# EAGLE design circuit5 (EAGLE 7.1.0)
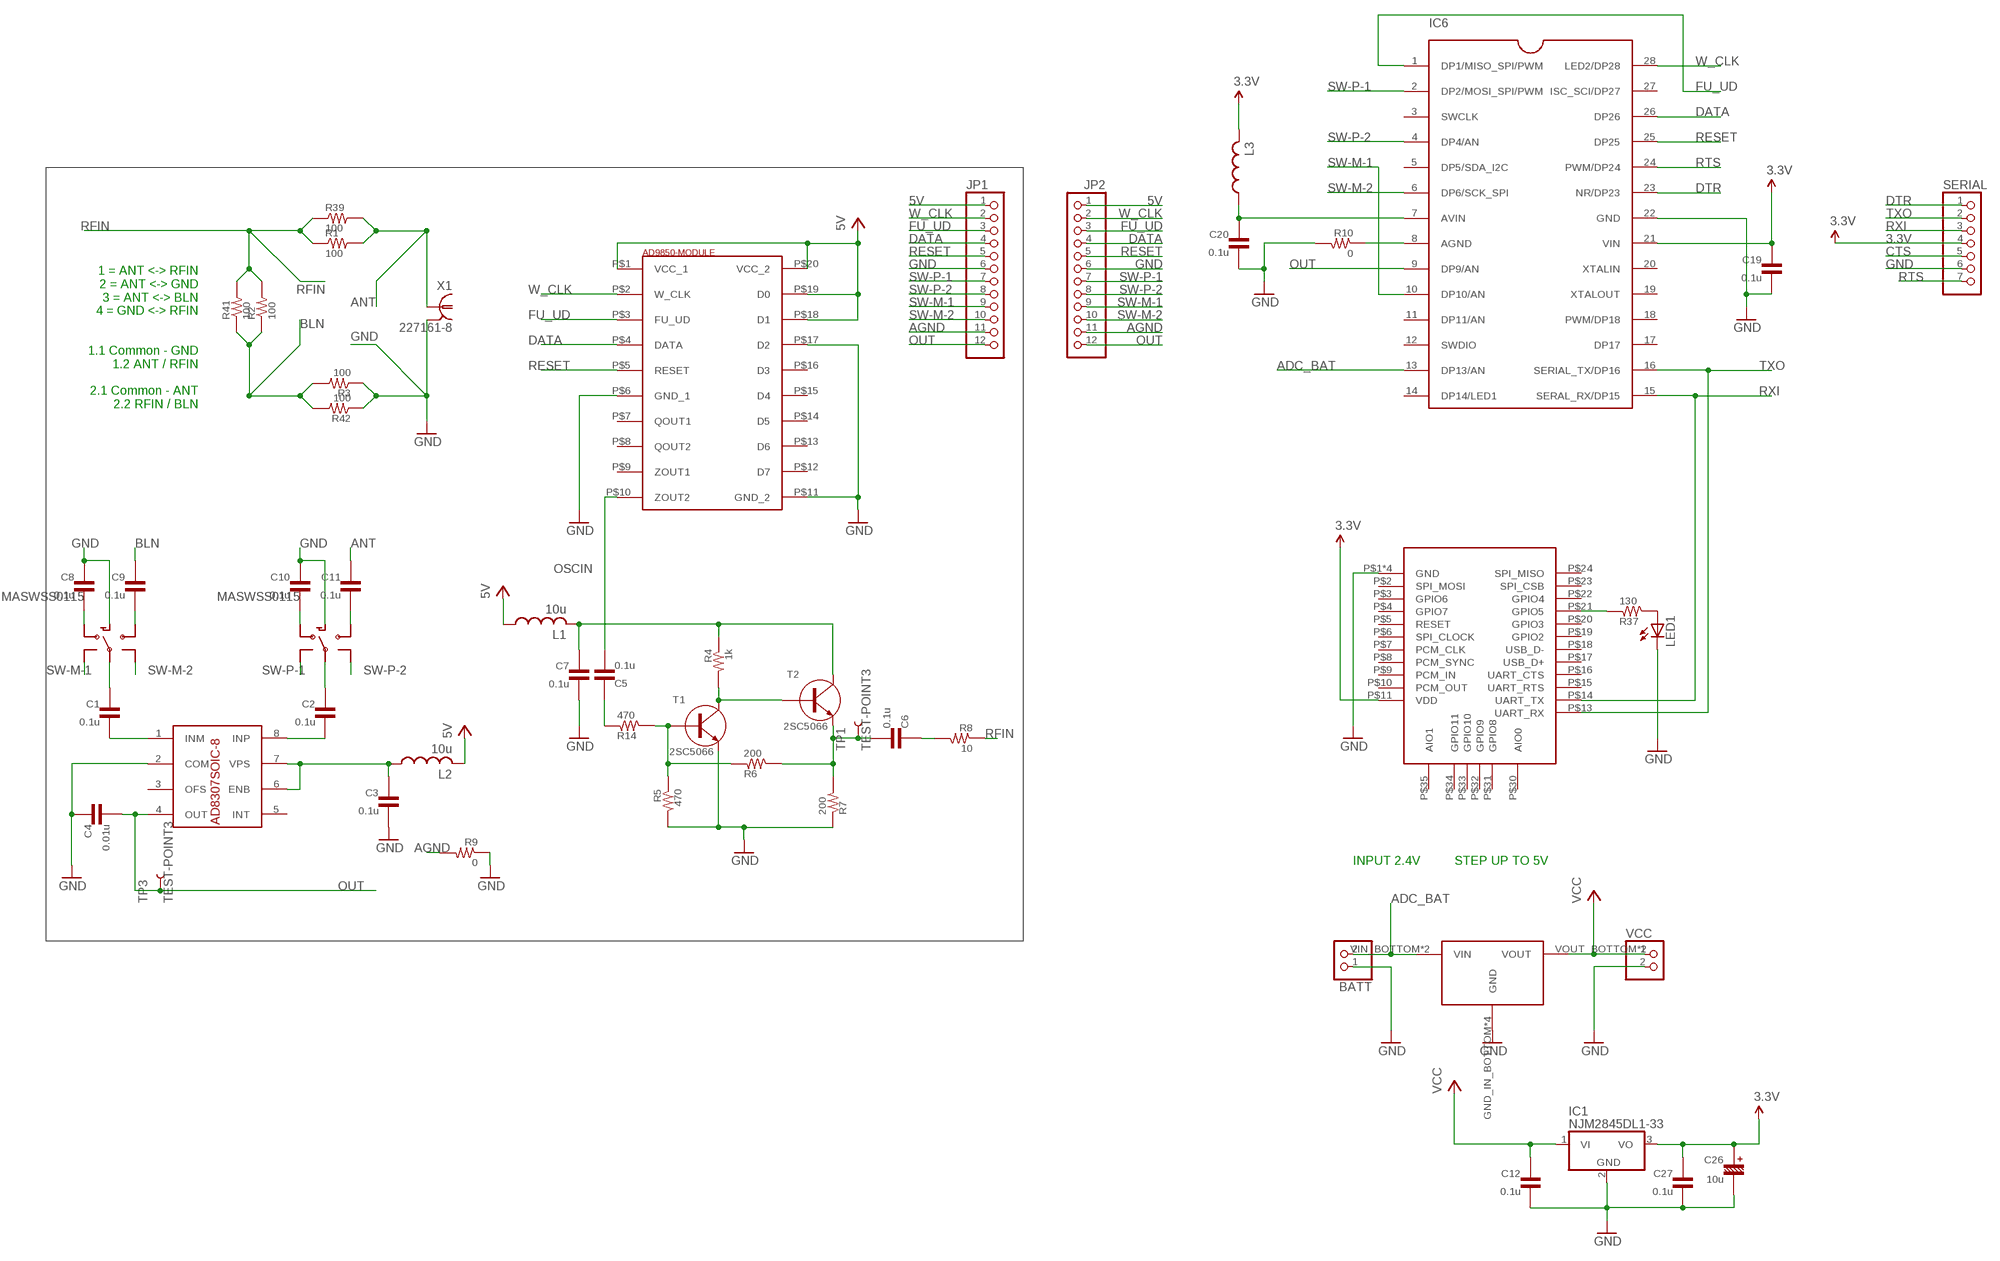
[diagram p0: schematic, sheet 1]

## Parts
BATT  PINHD-1X2  [1X02]
C1  0.1u  C-CP-1608  [CP1608]
C2  0.1u  C-CP-1608  [CP1608]
C3  0.1u  C-CP-1608  [CP1608]
C4  0.01u  C-CP-1608  [CP1608]
C5  0.1u  C-CP-1608  [CP1608]
C6  0.1u  C-CP-1608  [CP1608]
C7  0.1u  C-CP-1608  [CP1608]
C8  0.1u  C-CP-1608  [CP1608]
C9  0.1u  C-CP-1608  [CP1608]
C10  0.1u  C-CP-1608  [CP1608]
C11  0.1u  C-CP-1608  [CP1608]
C12  0.1u  C-CP-1608  [CP1608]
C19  0.1u  C-CP-1608  [CP1608]
C20  0.1u  C-CP-1608  [CP1608]
C26  10u  CE-16V-04-2.54  [16V-4-2.54]
C27  0.1u  C-CP-1608  [CP1608]
IC1  NJM2845DL1-33  7805DT  [TO252]
IC6  LPC1114FN28  [DIP28]
JP1  PINHD-1X12  [1X12]
JP2  PINHD-1X12  [1X12]
L1  10u  L-  [CP1608]
L2  10u  L-  [CP1608]
L3  L-  [CP1608]
LED1  LED3MM  [LED3MM]
R1  100  R-CP-1608  [CP1608]
R2  100  R-CP-1608  [CP1608]
R3  100  R-CP-1608  [CP1608]
R4  1k  R-CP-1608  [CP1608]
R5  470  R-CP-1608  [CP1608]
R6  200  R-CP-1608  [CP1608]
R7  200  R-CP-1608  [CP1608]
R8  10  R-CP-1608  [CP1608]
R9  0  R-CP-1608  [CP1608]
R10  0  R-CP-1608  [CP1608]
R14  470  R-CP-1608  [CP1608]
R37  130  R-CP-1608  [CP1608]
R39  100  R-CP-1608  [CP1608]
R41  100  R-CP-1608  [CP1608]
R42  100  R-CP-1608  [CP1608]
SERIAL  PINHD-1X7  [1X07]
T1  2SC5066  TR-NPN-SSM  [SSM]
T2  2SC5066  TR-NPN-SSM  [SSM]
TP1  TEST-POINT3  [PAD.03X.03]
TP3  TEST-POINT3  [PAD.03X.03]
U$1  AD9850-MODULE  [AD9850-MODULE]
U$2  RN-42  [RN-42]
U$3  AD8307SOIC-8  [SO08]
U$4  DC-DCSX1308  [DC-DC-SX1308]
U$5  MASWSS0115  [SOT363]
U$6  MASWSS0115  [SOT363]
VCC  PINHD-1X2  [1X02]
X1  227161-8  [AMP_227161]

## Nets
3.3V: C19.SMD1 C26.+ C27.SMD1 IC1.3(VO) IC6.21(VIN) L3.SMD2 SERIAL.4 U$2.P$11(VDD)
5V: C12.SMD1 IC1.1(VI) JP1.1 JP2.1 L1.SMD1 L2.SMD2 U$1.P$1(VCC_1) U$1.P$18(D1) U$1.P$19(D0) U$1.P$20(VCC_2) U$4.VOUT_BOTTOM(VOUT) U$4.VOUT_TOP(VOUT) VCC.1 ; supply symbol labelled VCC
+12V-ANALOG: C7.SMD1 L1.SMD2 R4.SMD1 T2.P$3(C)
ADC_BAT: BATT.2 IC6.13(DP13/AN) U$4.VIN_BOTTOM(VIN) U$4.VIN_TOP(VIN)
AGND: IC6.8(AGND) JP1.11 JP2.11 R9.SMD2 R10.SMD1
ANT: C11.SMD1 R1.SMD2 R39.SMD2 X1.1
BLN: C9.SMD1 R2.SMD1 R3.SMD2 R41.SMD1 R42.SMD2
CTS: SERIAL.5
DATA: IC6.26(DP26) JP1.4 JP2.4 U$1.P$4(DATA)
DTR: IC6.23(NR/DP23) SERIAL.1
FU_UD: IC6.1(DP1/MISO_SPI/PWM) JP1.3 JP2.3 U$1.P$3(FU_UD)
GND: BATT.1 C3.SMD2 C4.SMD1 C7.SMD2 C8.SMD1 C10.SMD1 C12.SMD2 C19.SMD2 C20.SMD2 C26.- C27.SMD2 IC1.2(GND) IC6.22(GND) JP1.6 JP2.6 LED1.K(C) R3.SMD1 R5.SMD2 R7.SMD1 R9.SMD1 R10.SMD2 R42.SMD1 SERIAL.6 T1.P$2(E) U$1.P$6(GND_1) U$1.P$11(GND_2) U$1.P$17(D2) U$2.P$1(GND) U$2.P$12(GND) U$2.P$28(GND) U$2.P$29(GND) U$3.2(COM) U$4.GND_IN_BOTTOM(GND) U$4.GND_IN_TOP(GND) U$4.GND_OUT_BOTTOM(GND) U$4.GND_OUT_TOP(GND) U$5.2(GND) U$6.2(GND) VCC.2 X1.2
N$1: C2.SMD1 U$6.5(COMMON)
N$2: C1.SMD1 U$5.5(COMMON)
N$4: R4.SMD2 T1.P$3(C) T2.P$1(B)
N$5: R5.SMD1 R6.SMD1 R14.SMD2 T1.P$1(B)
N$6: C8.SMD2 U$5.3(RF2)
N$7: C6.SMD2 R6.SMD2 R7.SMD2 T2.P$2(E) TP1.P$1
N$8: C1.SMD2 U$3.1(INM)
N$9: C2.SMD2 U$3.8(INP)
N$10: C3.SMD1 L2.SMD1 U$3.6(ENB) U$3.7(VPS)
N$11: C9.SMD2 U$5.1(RF1)
N$12: C10.SMD2 U$6.3(RF2)
N$13: C5.SMD1 R14.SMD1
N$14: C11.SMD2 U$6.1(RF1)
N$23: C6.SMD1 R8.SMD2
N$31: C20.SMD1 IC6.7(AVIN) L3.SMD1
N$32: LED1.A R37.SMD2
N$33: R37.SMD1 U$2.P$21(GPIO5)
OSCIN: C5.SMD2 U$1.P$10(ZOUT2)
OUT: C4.SMD2 IC6.9(DP9/AN) JP1.12 JP2.12 TP3.P$1 U$3.4(OUT)
RESET: IC6.25(DP25) JP1.5 JP2.5 U$1.P$5(RESET)
RFIN: R1.SMD1 R2.SMD2 R8.SMD1 R39.SMD1 R41.SMD2
RTS: IC6.24(PWM/DP24) SERIAL.7
RXI: IC6.15(SERAL_RX/DP15) SERIAL.3 U$2.P$14(UART_TX)
SW-M-1: IC6.10(DP10/AN) JP1.9 JP2.9 U$5.4(V2)
SW-M-2: IC6.6(DP6/SCK_SPI) JP1.10 JP2.10 U$5.6(V1)
SW-P-1: IC6.2(DP2/MOSI_SPI/PWM) JP1.7 JP2.7 U$6.4(V2)
SW-P-2: IC6.4(DP4/AN) JP1.8 JP2.8 U$6.6(V1)
TXO: IC6.16(SERIAL_TX/DP16) SERIAL.2 U$2.P$13(UART_RX)
W_CLK: IC6.28(LED2/DP28) JP1.2 JP2.2 U$1.P$2(W_CLK)
Unconnected: IC6.3(SWCLK) IC6.5(DP5/SDA_I2C) IC6.11(DP11/AN) IC6.12(SWDIO) IC6.14(DP14/LED1) IC6.17(DP17) IC6.18(PWM/DP18) IC6.19(XTALOUT) IC6.20(XTALIN) IC6.27(ISC_SCI/DP27) U$1.P$7(QOUT1) U$1.P$8(QOUT2) U$1.P$9(ZOUT1) U$1.P$12(D7) U$1.P$13(D6) U$1.P$14(D5) U$1.P$15(D4) U$1.P$16(D3) U$2.P$2(SPI_MOSI) U$2.P$3(GPIO6) U$2.P$4(GPIO7) U$2.P$5(RESET) U$2.P$6(SPI_CLOCK) U$2.P$7(PCM_CLK) U$2.P$8(PCM_SYNC) U$2.P$9(PCM_IN) U$2.P$10(PCM_OUT) U$2.P$15(UART_RTS) U$2.P$16(UART_CTS) U$2.P$17(USB_D+) U$2.P$18(USB_D-) U$2.P$19(GPIO2) U$2.P$20(GPIO3) U$2.P$22(GPIO4) U$2.P$23(SPI_CSB) U$2.P$24(SPI_MISO) U$2.P$30(AIO0) U$2.P$31(GPIO8) U$2.P$32(GPIO9) U$2.P$33(GPIO10) U$2.P$34(GPIO11) U$2.P$35(AIO1) U$3.3(OFS) U$3.5(INT)

## Notes on the sheet
- 1 = ANT <-> RFIN
  2 = ANT <-> GND
  3 = ANT <-> BLN
  4 = GND <-> RFIN
  
  
  1.1 Common - GND
  1.2 ANT / RFIN
  
  2.1 Common - ANT
  2.2 RFIN / BLN
- INPUT 2.4V | STEP UP TO 5V

## Library data of the parts
BATT VCC = pinhead:PINHD-1X2: PIN HEADER
C1-C12 C19 C20 C27 = my:C-: CAPACITOR Japanese symbol
C26 = my:CE-: ELECTROLYTIC CAPACITOR Japanese symbol
IC1 = my:78*: Positive VOLTAGE REGULATOR Source: http://cache.national.com/ds/LM/LM78L05.pdf http://www.fairchildsemi.com/ds/LM/LM7805.pdf
IC6 = lpc1114fn28:LPC1114FN28
JP1 JP2 = pinhead:PINHD-1X12: PIN HEADER
L1-L3 = my:L-: INDUCTOR, American symbol
LED1 = SparkFun-LED:LED: LEDs Standard schematic elements and footprints for 5mm, 3mm, 1206, and 0603 sized LEDs. 5mm - Spark Fun Electronics SKU : COM-00529 (and others)
R1-R10 R14 R37 R39 R41 R42 = my:R-: RESISTOR Japanese symbol
SERIAL = pinhead:PINHD-1X7: PIN HEADER
T1 T2 = my:TR-NPN-: TRANSISTOR (Bipolar transistor) NPN type Japanese symbol
TP1 TP3 = SparkFun-Passives:TEST-POINT: Bare copper test points for troubleshooting or ICT
U$1 = my:AD9850-MODULE
U$2 = my:RN-42
U$3 = my:AD8307
U$4 = my:DC-DC
U$5 U$6 = my:MASWSS0115
X1 = con-coax:?227161*: JACK, RIGHT ANGLE, 50 OHM, PCB, BNC Source: amp_227161.pdf; OC_FARNELL: unknown; OC_NEWARK: unknown

## Board
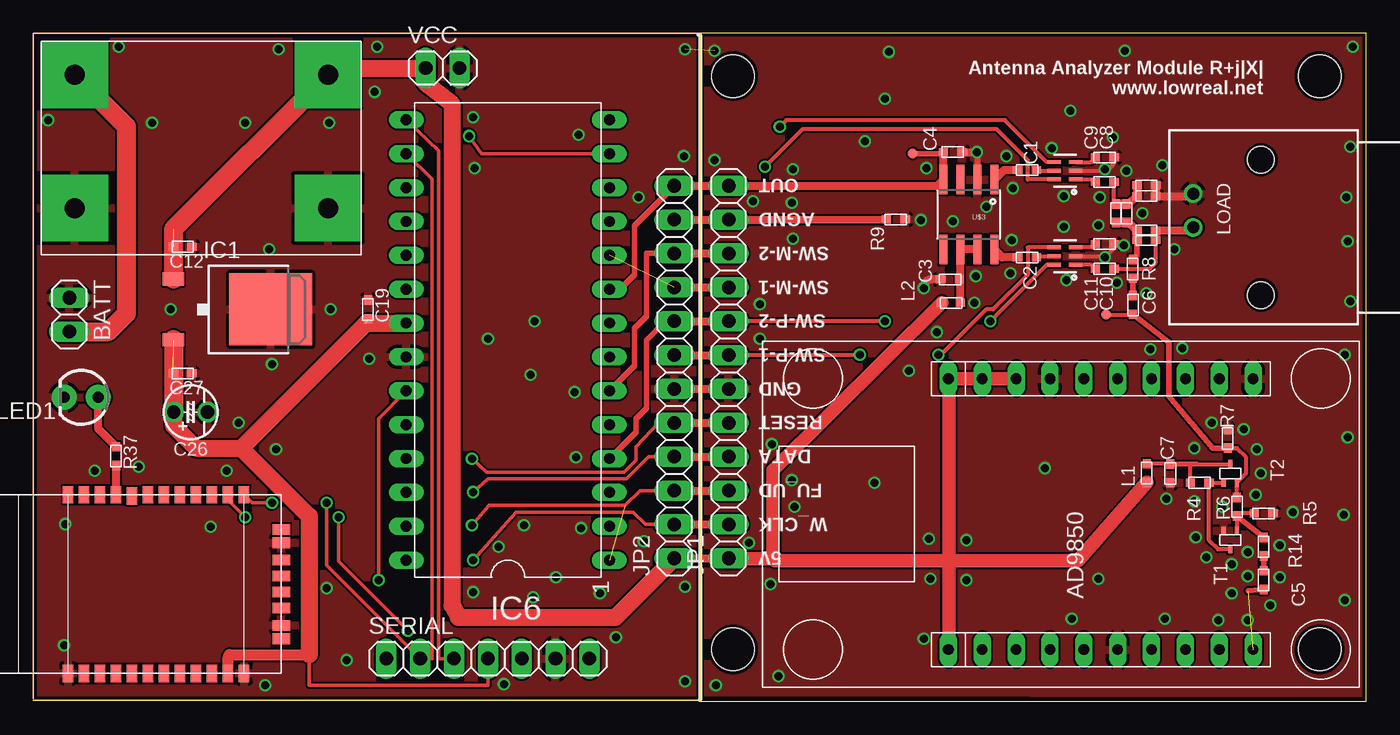
[diagram p1: board, top side]
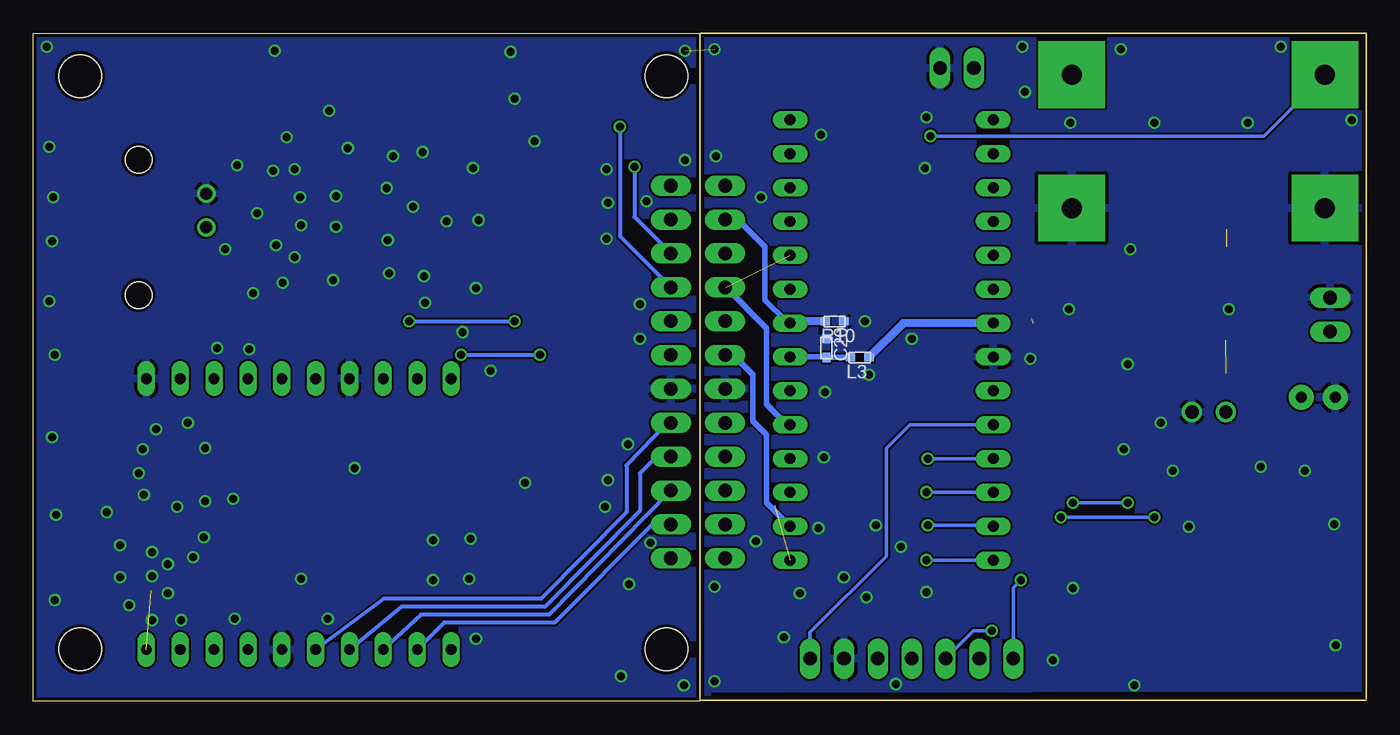
[diagram p2: board, bottom side, seen from below]

Size 100 x 50.1 mm. Coordinates in mm from the lower left corner, seen from the top.
Outline: 50,0.1 50,0 100,0 100,50.1 50,50.1
Outline: 0,0.1 50,0.1
Outline: 0,0.2 0,50.1 50,50.1
Outline: 50,50.1 50,0.1
Copper layers (1*16): Top 0.035mm / dielectric 1.5mm / Bottom 0.035mm
Design rules "Elecrow_2-layer_eagle_rule": minimum track width 6mil, minimum drill 12mil, track to track 6mil, track to pad 6mil, pad to pad 6mil, via to via 6mil, smd to smd 0mil, copper to edge 10mil, drill to drill 10mil, minimum pad ring 10mil, minimum via ring 6mil, stop-mask expansion 2mil, vias tented up to drill 100mil, thermal gap 10mil
Holes 3.2 mm at 96.5,46.9 52.5,46.9 52.5,3.9 96.5,3.9

### Footprints (pad centres in the part's own frame; a part is rotated, then mirrored left to right if it is on the bottom)
1X02 = drill 1.016 long: 1 -1.27,0; 2 1.27,0
CP1608 = smd 0.7 x 0.6: SMD1 -0.7,0; SMD2 0.7,0
16V-4-2.54 = drill 1: + -1.27,0; - 1.27,0
TO252 = smd 1 x 1.6: 1 -2.28,-4.8; 3 2.28,-4.8 | smd 5.4 x 6.2: 2 0,2.5
DIP28 = drill 0.813 long: 1 -16.51,-7.62; 2 -13.97,-7.62; 3 -11.43,-7.62; 4 -8.89,-7.62; 5 -6.35,-7.62; 6 -3.81,-7.62; 7 -1.27,-7.62; 8 1.27,-7.62; 9 3.81,-7.62; 10 6.35,-7.62; 11 8.89,-7.62; 12 11.43,-7.62; 13 13.97,-7.62; 14 16.51,-7.62; 15 16.51,7.62; 16 13.97,7.62; 17 11.43,7.62; 18 8.89,7.62; 19 6.35,7.62; 20 3.81,7.62; 21 1.27,7.62; 22 -1.27,7.62; 23 -3.81,7.62; 24 -6.35,7.62; 25 -8.89,7.62; 26 -11.43,7.62; 27 -13.97,7.62; 28 -16.51,7.62
1X12 = drill 1.016 long: 1 -13.97,0; 2 -11.43,0; 3 -8.89,0; 4 -6.35,0; 5 -3.81,0; 6 -1.27,0; 7 1.27,0; 8 3.81,0; 9 6.35,0; 10 8.89,0; 11 11.43,0; 12 13.97,0
LED3MM = drill 0.813 pad 1.88: A -1.27,0; K 1.27,0
1X07 = drill 1.016 long: 1 -7.62,0; 2 -5.08,0; 3 -2.54,0; 4 0,0; 5 2.54,0; 6 5.08,0; 7 7.62,0
SSM = smd 0.305 x 0.61: P$1 -0.5,-0.7; P$2 0.5,-0.7; P$3 0,0.7
PAD.03X.03 = smd 0.762 x 0.762: P$1 0,0
AD9850-MODULE = drill 0.8 long: P$1 -5.08,2.54; P$2 -5.08,0; P$3 -5.08,-2.54; P$4 -5.08,-5.08; P$5 -5.08,-7.62; P$6 -5.08,-10.16; P$7 -5.08,-12.7; P$8 -5.08,-15.24; P$9 -5.08,-17.78; P$10 -5.08,-20.32; P$11 15.24,-20.32; P$12 15.24,-17.78; P$13 15.24,-15.24; P$14 15.24,-12.7; P$15 15.24,-10.16; P$16 15.24,-7.62; P$17 15.24,-5.08; P$18 15.24,-2.54; P$19 15.24,0; P$20 15.24,2.54
RN-42 = smd 1.3 x 0.8: P$1 0,16; P$2 0,14.8; P$3 0,13.6; P$4 0,12.4; P$5 0,11.2; P$6 0,10; P$7 0,8.8; P$8 0,7.6; P$9 0,6.4; P$10 0,5.2; P$11 0,4; P$12 0,2.8; P$13 13.4,2.8; P$14 13.4,4; P$15 13.4,5.2; P$16 13.4,6.4; P$17 13.4,7.6; P$18 13.4,8.8; P$19 13.4,10; P$20 13.3,11.2; P$21 13.4,12.4; P$22 13.4,13.6; P$23 13.4,14.8; P$24 13.4,16 | smd 0.8 x 1.3: P$28 9.8,0; P$29 3.6,0; P$30 10.8,0; P$31 8.5,0; P$32 7.3,0; P$33 6.1,0; P$34 4.9,0; P$35 2.6,0
SO08 = smd 0.61 x 2.21: 1 -1.905,-2.616; 2 -0.635,-2.616; 3 0.635,-2.616; 4 1.905,-2.616; 5 1.905,2.616; 6 0.635,2.616; 7 -0.635,2.616; 8 -1.905,2.616
DC-DC-SX1308 = drill 1.5 pad 5 square: GND_IN_BOTTOM 0.5,1.5; GND_OUT_BOTTOM 19.5,1.5; VIN_BOTTOM 0.5,11.5; VOUT_BOTTOM 19.5,11.5 | smd 5 x 5: GND_IN_TOP 0.5,1.5; GND_OUT_TOP 19.5,1.5; VIN_TOP 0.5,11.5; VOUT_TOP 19.5,11.5
SOT363 = smd 0.3 x 0.99: 1 -0.65,-0.8; 2 0,-0.8; 3 0.65,-0.8; 4 0.65,0.81; 5 0,0.81; 6 -0.65,0.81
AMP_227161 = drill 0.9 pad 1.27: 1 0,-5.08; 2 -2.54,-5.08 | hole 2: -5.08,0; 5.08,0

### Placement (x,y rotation side)
BATT  2.7,29 270 top
C1  74.56,39.85 180 top
C2  74.56,33.3 180 top
C3  68.78,31.65 180 top
C4  68.98,41.2 180 top
C5  92.3,9.1 270 top
C6  82.5,29.73 270 top
C7  85.3,17.1 270 top
C8  80.38,40.8 180 top
C9  80.38,38.95 180 top
C10  80.38,34.3 180 top
C11  80.38,32.45 180 top
C12  11.2,34.1 0 top
C19  25.1,29.4 90 top
C20  40.5,26.5 90 bottom
C26  11.8,21.7 0 top
C27  11.2,24.6 0 top
IC1  15.3,29.4 270 top
IC6  35.6,27.1 90 top
JP1  52.16,24.7 90 top
JP2  48.1,24.7 90 top
L1  83.53,17.12 90 top
L2  68.86,29.88 180 top
L3  38,25.8 0 bottom
LED1  3.6,22.8 180 top
R1  83.5,35.3 0 top
R2  82,36.61 270 top
R3  83.5,38.7 180 top
R4  87.5,16.4 0 top
R5  92.3,14.1 0 top
R6  90.3,14.6 90 top
R7  89.6,19.7 270 top
R8  82.48,32.43 270 top
R9  64.7,36.14 180 top
R10  39.9,28.5 0 bottom
R14  92.3,11.6 90 top
R37  6.2,18.4 90 top
R39  83.5,34.6 0 top
R41  81.23,36.61 270 top
R42  83.5,37.9 180 top
SERIAL  34.1,3.2 0 top
T1  89.8,12.1 180 top
T2  89.8,17.1 0 top
TP1  80.5,29 270 top
TP3  65.98,41.08 270 top
U$1  71.2,8.96 90 top
U$2  18.6,2.1 90 top
U$3  70.19,36.51 180 top
U$4  2.6,35.5 0 top
U$5  77.4,39.8 90 top
U$6  77.4,33.4 90 top
VCC  30.7,47.5 0 top
X1  92.1,35.54 270 top

### Tracks (layer width: path | path; a pad name or v marks a point on that pad's centre or on a via)
3.3V  (2 unrouted)
  Top 0.254: 20.7,3.5 20.7,1.2 34.1,1.2 SERIAL.4
  Top 0.813: U$2.P$11 14.6,3.2 14.7,3.5 20.7,3.5
  Top 1.27: C26.+ 10.53,20.67 12.2,19 15.6,19 | 15.6,19 20.7,13.9 20.7,3.5 | 15.6,19 24.97,28.37 IC6.21
  Top 1.422: IC1.3 10.53,27.09 C26.+
  Bottom 0.61: IC6.21 34.73,28.37 L3.SMD2
5V  (1 unrouted)
  Top 0.61: JP2.1 JP1.1
  Top 1.016: JP1.1 52.19,10.7 55.5,10.7 | 55.5,10.7 55.5,17.32 L2.SMD2 | 55.5,10.7 55.65,10.55 68.7,10.55 | U$1.P$18 U$1.P$19 U$1.P$20 68.7,24.16 68.7,10.55 | L1.SMD1 78.36,10.55 68.7,10.55 | U$1.P$1 68.7,3.92 68.7,10.55
  Top 1.27: 22.6,47.5 VCC.1 29.43,46.37 31.4,44.8 31.4,7.2 31.9,6.3 43.67,6.3 JP2.1
  Top 1.422: 22.6,47.5 U$4.VOUT_BOTTOM 10.5,35.4 IC1.1
+12V-ANALOG
  Top 0.305: T2.P$3 C7.SMD1 87.28,17.82 86.8,17.82 | 86.8,17.82 L1.SMD2 | R4.SMD1 86.8,17.82
ADC_BAT  (via drill 0.6)
  Top 0.254: IC6.13 33.63,41.07 v32.7,42.4
  Top 1.422: BATT.2 5.63,27.73 7,29.1 7,43.1 U$4.VIN_TOP
  Bottom 0.254: v32.7,42.4 7.7,42.4 U$4.VIN_TOP
AGND
  Top 0.61: R9.SMD2 54.79,36.13 JP1.11 JP2.11
  Bottom 0.406: 43.09,28.5 43.5,28.5 45.1,30.1 45.1,34.1 47.13,36.13 JP2.11
  Bottom 0.61: R10.SMD1 43.09,28.5 IC6.8
ANT
  Top 0.305: C11.SMD1 83.75,32.45 84.2,32.9 R39.SMD2
  Top 0.61: R39.SMD2 R1.SMD2 86.78,35.3 X1.1
BLN
  Top 0.305: R41.SMD1 81.08,37.31 C9.SMD1
  Top 0.61: R3.SMD2 R42.SMD2 82.21,37.31 R2.SMD1 R41.SMD1
DATA  (via drill 0.6)
  Top 0.254: JP2.4 46.15,18.35 44.5,16.7 34.1,16.7 v33,15.7
  Top 0.61: JP2.4 JP1.4
  Bottom 0.254: v33,15.7 28.01,15.7 IC6.26
  Bottom 0.305: JP1.4 53.25,18.35 54.5,17.1 54.5,14.3 61.6,7.1 72.36,7.1 U$1.P$4
DTR  (via drill 0.6)
  Top 0.254: v25.9,9.1 25.9,21.21 IC6.23
  Bottom 0.254: SERIAL.1 26.48,8.52 v25.9,9.1
FU_UD  (via drill 0.6)  (1 unrouted)
  Top 0.254: JP2.3 45.51,15.81 44.4,14.7 34.2,14.7 v32.9,13.2
  Top 0.61: JP2.3 JP1.3
  Bottom 0.254: v32.9,13.2 28.05,13.2
  Bottom 0.305: JP1.3 52.19,15.81 61.3,6.5 70.92,6.5 U$1.P$3
GND  (via drill 0.6)  (1 unrouted)
  Top 0.305: C8.SMD1 81.08,40.58 arc-90 v80.4,39.9 80.4,39.8 U$5.2 | C10.SMD1 81.08,33.98 v80.4,33.3 arc90 80.3,33.4 U$6.2
  Top 0.406: U$3.2 70.83,41.27 v70.8,41.2
  Top 0.61: R3.SMD1 R42.SMD1 | 84.2,38.08 R42.SMD1 | R42.SMD1 86.84,37.9 X1.2 | C4.SMD1 v70.8,41.2 | C3.SMD2 67.35,31.65 arc90 v66.8,31 | JP2.6 JP1.6
  other vias: 80,37.8 77.5,31.6 83.5,30.6 90.8,20.4 93.5,9.3 66.6,36.1 73,40.9 76.4,41.5 73.3,32.1 87.1,19 91.7,15.5 67.3,9.2 70,9.1 70,12.1 67.2,12.2 91.1,11.2 88.4,20.9 89.2,14.6 87.1,15 99,49.1 51.1,48.8 51.2,1.2 55.4,19.3 56.9,16.6 66.8,4.7 55.3,8.8 53.7,11.9 71.5,37.1 69,36 70.6,29.9 81.3,31.4 83.2,36.6 73.4,34.6 73.5,38.5 67,40 57,39.9 54.5,29.8 54,37.5 56.9,37.4 57,34.7 94.5,14.2 51.1,40.6 62.4,42 79.9,35.7 81.8,34.2 82,39.8 77.3,37.9 77.3,35.6 83.8,26.4 86.2,26.5 88.9,6.1 91.1,6.1 91.1,9.4 92.8,7.2 89.9,8.1 89.9,10.3 92.1,17.1 88,10.8 87.2,12.3 85,15.2 91.8,18.9 93.5,11.7 70.7,31.9 67.8,27.7 65.7,24.8 54.5,27.2 81,42.3 84.7,40.2 85.6,33.9 13.3,13.1 2.3,4.2 2.4,13.3 22.3,29.4 17.7,33.9 17.9,25.3 15.4,20.9 14.5,17.3 7.9,17.6 4.6,17.3 18.2,18.9 25.2,25.7 37.6,28.5 40.6,23.2 34.1,27.2 37.3,24.5 34.9,11.6 33,8.2 36.8,13.2 41.1,13 42.5,8.1 45.8,12 8.9,43.4 1.1,43.6 22.2,43.4 15.9,43.4 6.4,49.1 18.4,48.9 25.8,49.1 25.6,45.7 23.5,3.1 22,8.5 17.4,1.2 37.5,7.8 39.2,9.3 10.3,29.4 48.9,48.9 48.9,1.5 48.9,8.6 35.3,1.3 43.7,4.8 40.7,18.3 57.1,14.6 63.1,16.4 75.9,17.5 79.9,9.2 77.9,6.2 84.9,6.2 55.9,1.9 64.2,48.7 81.9,48.8 63.9,45.2 77.8,44.3 98.8,41.6 98.5,37.8 98.6,34.5 98.8,30 98.4,26 98.6,19.8 98.3,14 98.4,7.6 33.1,40 33,43.8 40.9,42.5 45.4,37.8 48.8,40.9
  pour Bottom: 49.44,49.8 49.44,0.5 99.7,0.4 99.7,49.7
  pour Top: 49.48,50 49.48,0.7 100,0.6 100,49.9
  pour Bottom: -0.06,50.3 -0.06,1 50.2,0.9 50.2,50.2
  pour Top: -0.72,50 -0.72,0.7 49.8,0.6 49.8,49.9
N$1
  Top 0.305: C2.SMD1 75.36,33.4 U$6.5
N$2
  Top 0.305: C1.SMD1 75.31,39.8 U$5.5
N$4
  Top 0.305: T1.P$3 88.9,11.4 88.2,12.1 R4.SMD2 T2.P$1
N$5
  Top 0.305: T1.P$1 R6.SMD1 90.5,14.1 R5.SMD1
  Top 0.406: R6.SMD1 R14.SMD2
N$6
  Top 0.305: U$5.3 79.33,40.45 arc90 C8.SMD2
N$7
  Top 0.305: R6.SMD2 T2.P$2 91,17.1 91,18.3 90.3,19 R7.SMD2 90.2,19 | TP1.P$1 82.47,29 C6.SMD2
  Top 0.406: R7.SMD2 88.5,19 85.2,22.9 85.2,26.93 C6.SMD2
N$8
  Top 0.61: C1.SMD2 72.82,39.85 U$3.1
N$9
  Top 0.61: C2.SMD2 72.69,33.3 U$3.8
N$10
  Top 0.61: U$3.7 U$3.6 69.56,31.73 C3.SMD1 69.55,31.58 L2.SMD1
N$11
  Top 0.305: U$5.1 79.48,39.15 C9.SMD2
N$12
  Top 0.305: C10.SMD2 79.43,34.05 U$6.3
N$13
  Top 0.406: C5.SMD1 R14.SMD1
N$14
  Top 0.305: C11.SMD2 79.38,32.75 U$6.1
N$23
  Top 0.406: R8.SMD2 82.5,31.71 C6.SMD1
N$31
  Bottom 0.406: L3.SMD1 C20.SMD1 40.53,25.83 IC6.7
N$32
  Top 0.61: R37.SMD2 4.87,20.43 LED1.A
N$33
  Top 0.61: U$2.P$21 R37.SMD1
OSCIN  (1 unrouted)
  Top 0.406: C5.SMD2 91.15,8.3
OUT
  Top 0.406: C4.SMD2 68.16,41.08 TP3.P$1 | JP2.12 45.1,35.67 45.1,32 44.01,30.91 IC6.9
  Top 0.61: C4.SMD2 U$3.4 67.83,38.67 JP1.12 JP2.12
RESET  (via drill 0.6)
  Top 0.254: JP2.5 46.89,20.89 45.2,19.1 45.2,18.1 44.3,17.2 34,17.2 v32.9,18.2
  Top 0.61: JP2.5 JP1.5
  Bottom 0.254: v32.9,18.2 IC6.25
  Bottom 0.305: JP1.5 52.41,20.89 55.5,17.7 55.5,14.2 61.9,7.7 73.7,7.7 U$1.P$5
RFIN
  Top 0.406: R8.SMD1 82.8,33.45 R39.SMD1
  Top 0.61: R41.SMD2 R2.SMD2 82.19,35.91 R1.SMD1 R39.SMD1
RTS
  Bottom 0.254: SERIAL.7 41.72,5.18 36,10.9 36,19 34.25,20.75 IC6.24
RXI  (via drill 0.6)
  Top 0.254: IC6.15 30.4,41.29 30.4,3.2 SERIAL.3 | U$2.P$14 14.6,15.1 v15.9,13.8 | v22.9,13.8 22.9,10.5 v28.1,5.3
  Bottom 0.254: v15.9,13.8 v22.9,13.8 | v28.1,5.3 29.46,5.3 SERIAL.3
SW-M-1  (via drill 0.6)  (1 unrouted)
  Top 0.305: U$5.4 76.05,40.45 72.9,43.6 56.5,43.6 v56,43.1
  Top 0.61: JP2.9 JP1.9
  Bottom 0.305: v56,43.1 56,34.89 JP1.9
  Bottom 0.406: JP2.9 48.05,31.05 45,28 45,22.3 43.45,20.75
SW-M-2  (via drill 0.6)
  Top 0.305: U$5.6 74.6,39.15 74.6,40.6 72.3,42.9 57.7,42.9 v54.9,40.1
  Top 0.406: JP2.10 46,33.59 46,28.9 45.1,28 45.1,25.17 IC6.6
  Top 0.61: JP2.10 JP1.10
  Bottom 0.305: v54.9,40.1 54.9,36.33 JP1.10
SW-P-1  (via drill 0.6)
  Top 0.305: U$6.4 74.6,34.05 74.6,32 72,29.4 71.5,29.4 68.1,26 v67.9,26 | v62,26 61.97,25.97 JP1.7
  Top 0.61: JP2.7 JP1.7
  Bottom 0.305: v67.9,26 v62,26
  Bottom 0.406: JP2.7 47.47,25.97 46,24.5 46,21 45,20 45,14.91 IC6.2
SW-P-2  (via drill 0.6)
  Top 0.305: U$6.6 76.05,32.75 v71.8,28.5 | v63.9,28.5 JP1.8
  Top 0.406: JP2.8 47.41,28.51 46,27.1 46,22 45.2,21.2 45.2,20.19 IC6.4
  Top 0.61: JP2.8 JP1.8
  Bottom 0.305: v71.8,28.5 v63.9,28.5
TXO  (via drill 0.6)
  Top 0.254: IC6.16 29.9,39.15 29.9,3.2 SERIAL.2 22,10.22 v22,14.9 | U$2.P$13 16.4,14.9 v17.9,14.9
  Bottom 0.254: v17.9,14.9 v22,14.9
W_CLK  (via drill 0.6)
  Top 0.254: JP2.2 45.93,13.27 45,14.2 36.2,14.2 v33,10.6
  Top 0.61: JP2.2 JP1.2
  Bottom 0.254: v33,10.6 IC6.28
  Bottom 0.305: JP1.2 53.53,13.27 60.9,5.9 69.18,5.9 U$1.P$2

### Text on the board
tNames: Antenna Analyzer Module R+j|X| / www.lowreal.net | 5V / W_CLK / FU_UD / DATA / RESET / GND / SW-P-1 / SW-P-2 / SW-M-1 / SW-M-2 / AGND / OUT | LOAD